# EAGLE design opensourus_voltceraptor_v1 (EAGLE 8.2.1)
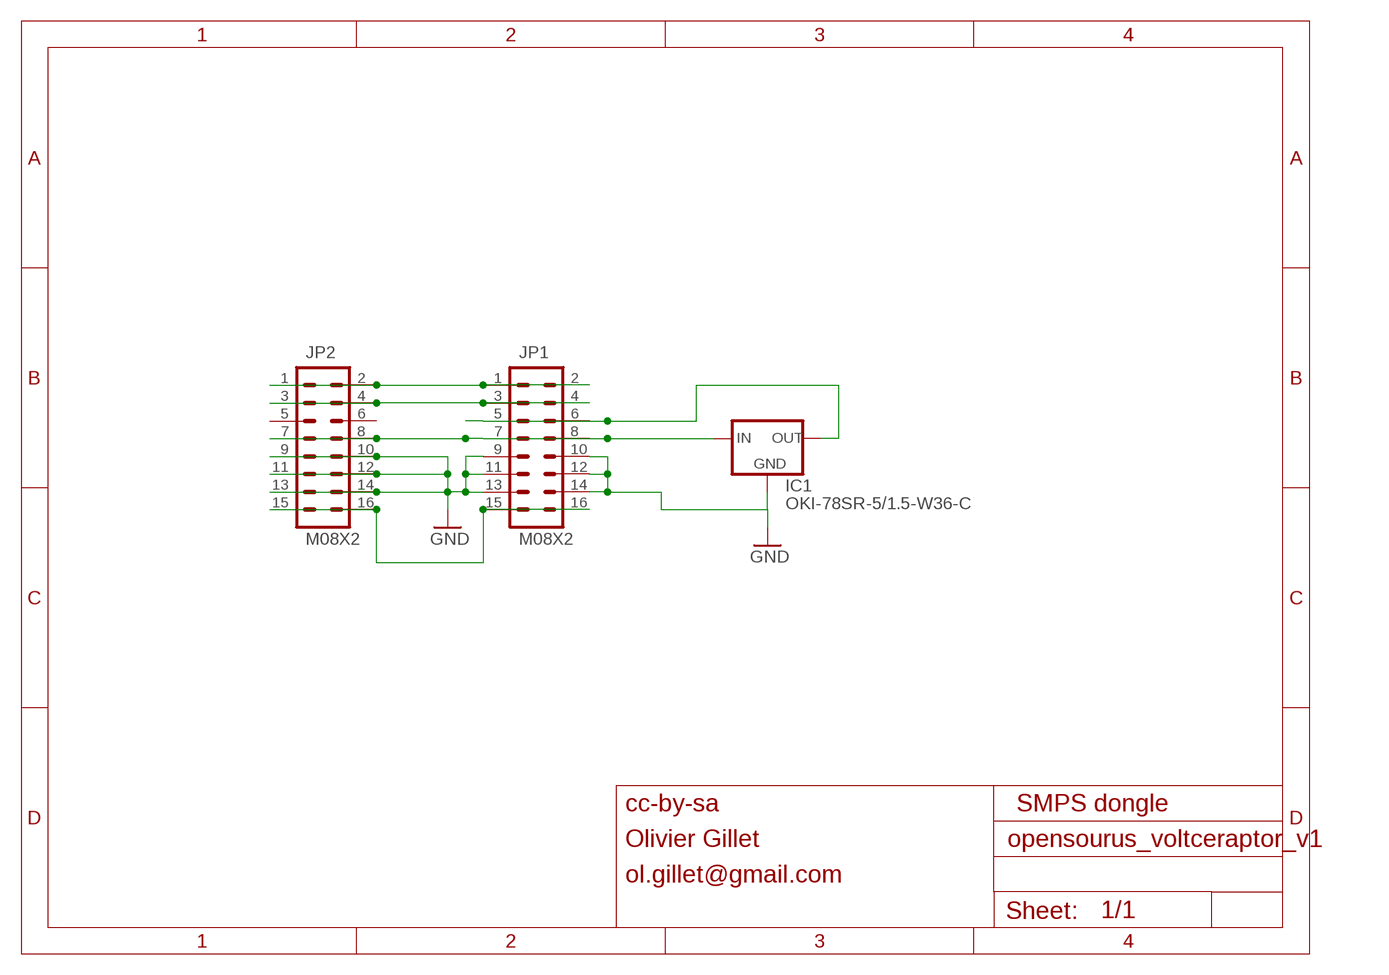
[diagram p0: schematic, sheet 1]

## Parts
IC1  OKI-78SR-5/1.5-W36-C  OKI-78SR  [OKI78SR]
JP1  M08X2  [2X8]
JP2  M08X2  [2X8]

## Nets
GND: IC1.2(GND) JP1.9 JP1.10 JP1.11 JP1.12 JP1.13 JP1.14 JP2.9 JP2.10 JP2.11 JP2.12 JP2.13 JP2.14
N$1: IC1.1(IN) JP1.7 JP1.8 JP2.7 JP2.8
N$2: IC1.3(OUT) JP1.5 JP1.6
N$3: JP1.15 JP1.16 JP2.15 JP2.16
N$4: JP1.1 JP1.2 JP2.1 JP2.2
N$5: JP1.3 JP1.4 JP2.3 JP2.4
Unconnected: JP2.5 JP2.6

## Notes on the sheet
- cc-by-sa | SMPS dongle
- Olivier Gillet
- ol.gillet@gmail.com

## Library data of the parts
IC1 = og-vreg:OKI-78SR
JP1 JP2 = SparkFun:M08X2

## Board
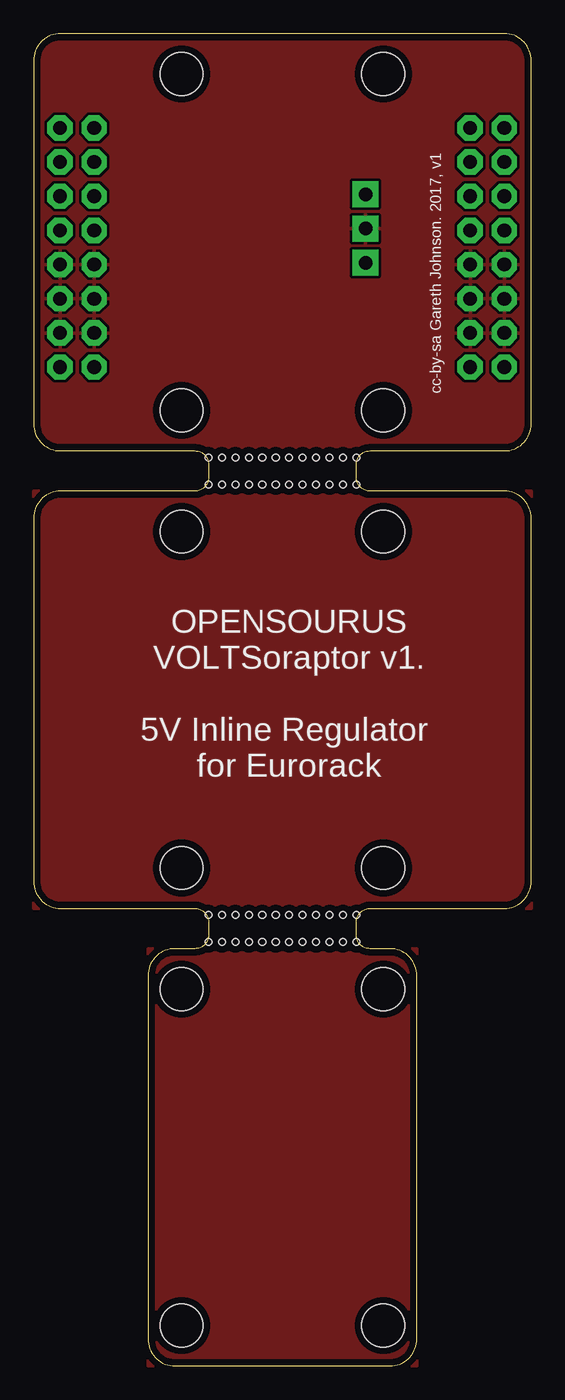
[diagram p1: board, top side]
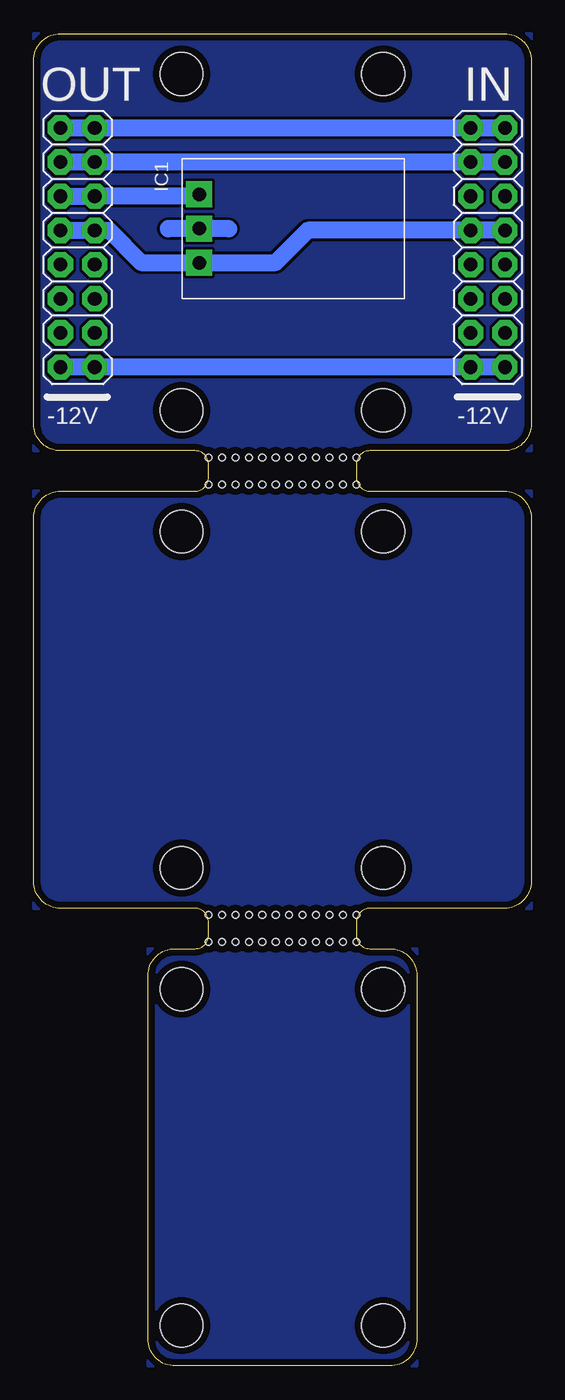
[diagram p2: board, bottom side, seen from below]

Size 37 x 99 mm. Coordinates in mm from the lower left corner, seen from the top.
Outline: 0,70 arc90 2,68 12,68 arc-90 13,67 13,66 arc-90 12,65 2,65 arc90 0,63 0,36 arc90 2,34 12,34 arc-90 13,33 13,32 arc-90 12,31 10.5,31 arc90 8.5,29 8.5,2 arc90 10.5,0 26.5,0 arc90 28.5,2 28.5,29 arc90 26.5,31 25,31 arc-90 24,32 24,33 arc-90 25,34 35,34 arc90 37,36 37,63 arc90 35,65 25,65 arc-90 24,66 24,67 arc-90 25,68 35,68 arc90 37,70 37,97 arc90 35,99 2,99 arc90 0,97 0,70
Copper layers (1*16): Top 0.035mm / dielectric 1.5mm / Bottom 0.035mm
Design rules "PCBCart-Standard *": minimum track width 8mil, minimum drill 0.4mm, track to track 8mil, track to pad 8mil, pad to pad 8mil, via to via 8mil, smd to smd 8mil, copper to edge 20mil, drill to drill 8mil, minimum pad ring 8mil, minimum via ring 10mil, stop-mask expansion 3mil, vias tented up to drill 0mil, thermal gap 8mil
Holes 3.2 mm at 11,71 26,71 11,96 26,96 11,28 11,3 26,28 26,3 11,62 26,62 11,37 26,37
Holes 0.5 mm at 13,67.5 14,67.5 15,67.5 16,67.5 17,67.5 18,67.5 19,67.5 20,67.5 21,67.5 22,67.5 23,67.5 24,67.5 13,65.5 14,65.5 15,65.5 16,65.5 17,65.5 18,65.5 19,65.5 20,65.5 21,65.5 22,65.5 23,65.5 24,65.5 13,33.5 14,33.5 15,33.5 16,33.5 17,33.5 18,33.5 19,33.5 20,33.5 21,33.5 22,33.5 23,33.5 24,33.5 13,31.5 14,31.5 15,31.5 16,31.5 17,31.5 18,31.5 19,31.5 20,31.5 21,31.5 22,31.5 23,31.5 24,31.5

### Footprints (pad centres in the part's own frame; a part is rotated, then mirrored left to right if it is on the bottom)
OKI78SR = drill 1 pad 1.93 square: 1 2.54,0; 2 0,0; 3 -2.54,0
2X8 = drill 1.016 pad 1.88 octagon: 1 0,0; 2 0,2.54; 3 2.54,0; 4 2.54,2.54; 5 5.08,0; 6 5.08,2.54; 7 7.62,0; 8 7.62,2.54; 9 10.16,0; 10 10.16,2.54; 11 12.7,0; 12 12.7,2.54; 13 15.24,0; 14 15.24,2.54; 15 17.78,0; 16 17.78,2.54

### Placement (x,y rotation side)
IC1  24.68,84.52 270 bottom
JP1  35,92 270 bottom
JP2  4.5,92 270 bottom

### Tracks (layer width: path | path; a pad name or v marks a point on that pad's centre or on a via)
GND
  Bottom 1.27: IC1.2 22.52,84.52 22.5,84.5 24.67,84.5 IC1.2 | IC1.2 26.98,84.52 27,84.5
  pour Top: 0,68 0,99 37,99 37,68
N$1
  Bottom 1.27: JP2.8 JP2.7 16.62,84.38 19,82 24.66,82 | 24.66,82 IC1.1 | 24.66,82 29,82 31.38,84.38 JP1.8 JP1.7
N$2
  Bottom 1.27: JP1.5 JP1.6 24.82,86.92 IC1.3
N$3
  Bottom 1.27: JP2.16 JP2.15 JP1.16 JP1.15
N$4
  Bottom 1.27: JP1.1 JP1.2 JP2.1 JP2.2
N$5
  Bottom 1.27: JP2.4 JP2.3 JP1.4 JP1.3
N$6
  pour Bottom: 0,68 0,99 37,99 37,68
N$7
  pour Bottom: 0,65 0,34 37,34 37,65
N$8
  pour Bottom: 8.5,0 8.5,31 28.5,31 28.5,0
N$9
  pour Top: 8.5,0 8.5,31 28.5,31 28.5,0
N$10
  pour Top: 0,34 0,65 37,65 37,34

### Text on the board
tPlace: OPENSOURUS / VOLTSoraptor v1. / / 5V Inline Regulator / for Eurorack
bPlace: IN | OUT | -12V | -12V
tNames: cc-by-sa Gareth Johnson. 2017, v1